# EAGLE design PSU (EAGLE 7.7.0)
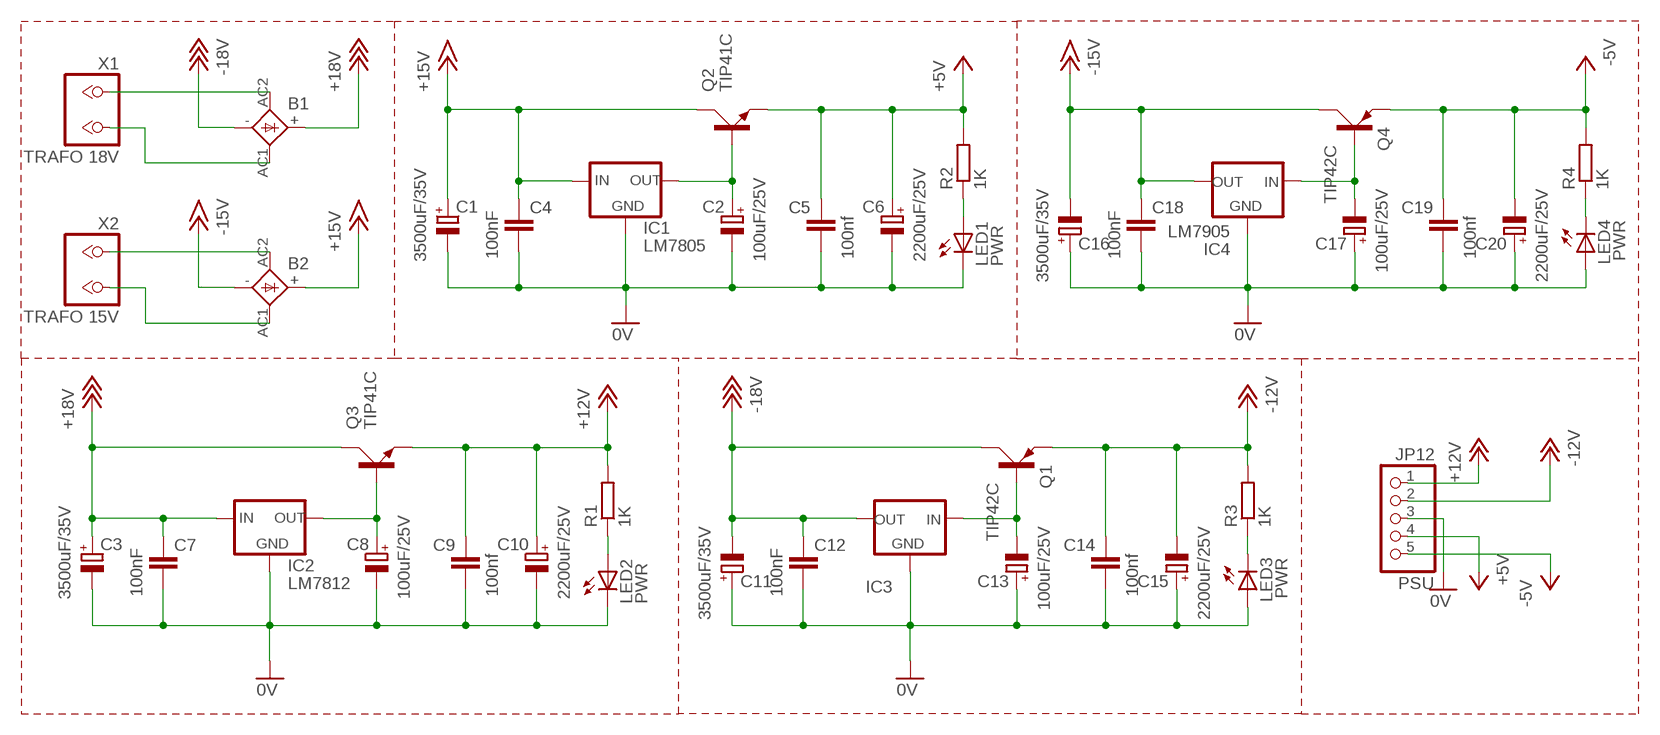
[diagram p0: schematic, sheet 1]

## Parts
B1  KBL  [KBL]
B2  KBL  [KBL]
C1  3500uF/35V  CPOL-EUE10-20  [EB20D]
C2  100uF/25V  CPOL-EUE2.5-7  [E2,5-7]
C3  3500uF/35V  CPOL-EUE10-20  [EB20D]
C4  100nF  C-EU050-025X075  [C050-025X075]
C5  100nf  C-EU050-025X075  [C050-025X075]
C6  2200uF/25V  CPOL-EUE5-13  [E5-13]
C7  100nF  C-EU050-025X075  [C050-025X075]
C8  100uF/25V  CPOL-EUE2.5-7  [E2,5-7]
C9  100nf  C-EU050-025X075  [C050-025X075]
C10  2200uF/25V  CPOL-EUE5-13  [E5-13]
C11  3500uF/35V  CPOL-EUE10-20  [EB20D]
C12  100nF  C-EU050-025X075  [C050-025X075]
C13  100uF/25V  CPOL-EUE2.5-7  [E2,5-7]
C14  100nf  C-EU050-025X075  [C050-025X075]
C15  2200uF/25V  CPOL-EUE5-13  [E5-13]
C16  3500uF/35V  CPOL-EUE10-20  [EB20D]
C17  100uF/25V  CPOL-EUE2.5-7  [E2,5-7]
C18  100nF  C-EU050-025X075  [C050-025X075]
C19  100nf  C-EU050-025X075  [C050-025X075]
C20  2200uF/25V  CPOL-EUE5-13  [E5-13]
IC1  LM7805  78XXS  [78XXS]
IC2  LM7812  78XXS  [78XXS]
IC3  79XXS  [79XXS]
IC4  LM7905  79XXS  [79XXS]
JP12  PSU  PINHD-1X5"  [1X05]
LED1  PWR  LEDLED3MM  [LED3MM]
LED2  PWR  LEDLED3MM  [LED3MM]
LED3  PWR  LEDLED3MM  [LED3MM]
LED4  PWR  LEDLED3MM  [LED3MM]
Q1  TIP42C  [TO220AV]
Q2  TIP41C  [TO220AV]
Q3  TIP41C  [TO220AV]
Q4  TIP42C  [TO220AV]
R1  1K  R-EU_0207/7  [0207/7]
R2  1K  R-EU_0207/7  [0207/7]
R3  1K  R-EU_0207/7  [0207/7]
R4  1K  R-EU_0207/7  [0207/7]
X1  TRAFO 18V  2PIN  [TB2]
X2  TRAFO 15V  2PIN  [TB2]

## Nets
0V: C1.- C2.- C3.- C4.2 C5.2 C6.- C7.2 C8.- C9.2 C10.- C11.+ C12.2 C13.+ C14.2 C15.+ C16.+ C17.+ C18.2 C19.2 C20.+ IC1.GND IC2.GND IC3.GND IC4.GND JP12.3 LED1.K(C) LED2.K(C) LED3.A LED4.A
+5V: C5.1 C6.+ JP12.4 Q2.E R2.2
+12V: C9.1 C10.+ JP12.1 Q3.E R1.2
+15V: B2.+ C1.+ C4.1 IC1.IN Q2.C
+18V: B1.+ C3.+ C7.1 IC2.IN Q3.C
-5V: C19.1 C20.- JP12.5 Q4.E R4.2
-12V: C14.1 C15.- JP12.2 Q1.E R3.2
-15V: B2.- C16.- C18.1 IC4.OUT Q4.C
-18V: B1.- C11.- C12.1 IC3.OUT Q1.C
N$1: B1.AC1(AC2) X1.2
N$2: B1.AC2(AC1) X1.1
N$3: C13.- IC3.IN Q1.B
N$4: LED1.A R2.1
N$5: C8.+ IC2.OUT Q3.B
N$6: C2.+ IC1.OUT Q2.B
N$7: LED2.A R1.1
N$8: LED3.K(C) R3.1
N$13: C17.- IC4.IN Q4.B
N$14: LED4.K(C) R4.1
N$15: B2.AC2(AC1) X2.1
N$16: B2.AC1(AC2) X2.2

## Library data of the parts
B1 B2 = rectifier:KBL: DIOTEC RECTIFIER
C1-C3 C6 C8 C10 C11 C13 C15-C17 C20 = FansElectronics-RCL:CPOL-EU: POLARIZED CAPACITOR, European symbol
C4 C5 C7 C9 C12 C14 C18 C19 = FansElectronics-RCL:C-EU: CAPACITOR, European symbol
IC1 IC2 = v-reg:78XXS: VOLTAGE REGULATOR
IC3 IC4 = v-reg:79XXS: VOLTAGE REGULATOR
JP12 = FansElectronics-Header:PINHD-1X5: PIN HEADER
LED1-LED4 = FansElectronics-LED:LED: LED : Tersedia berbagai ukuran dari DIL dan SMD
Q1 Q4 = transistor-power:TIP42C: PNP TRANSISTOR
Q2 Q3 = transistor-power:TIP41C: NPN TRANSISTOR
R1-R4 = FansElectronics-RCL:R-EU_: RESISTOR, European symbol
X1 X2 = FansElectronics-Con-Screw:2PIN

## Board
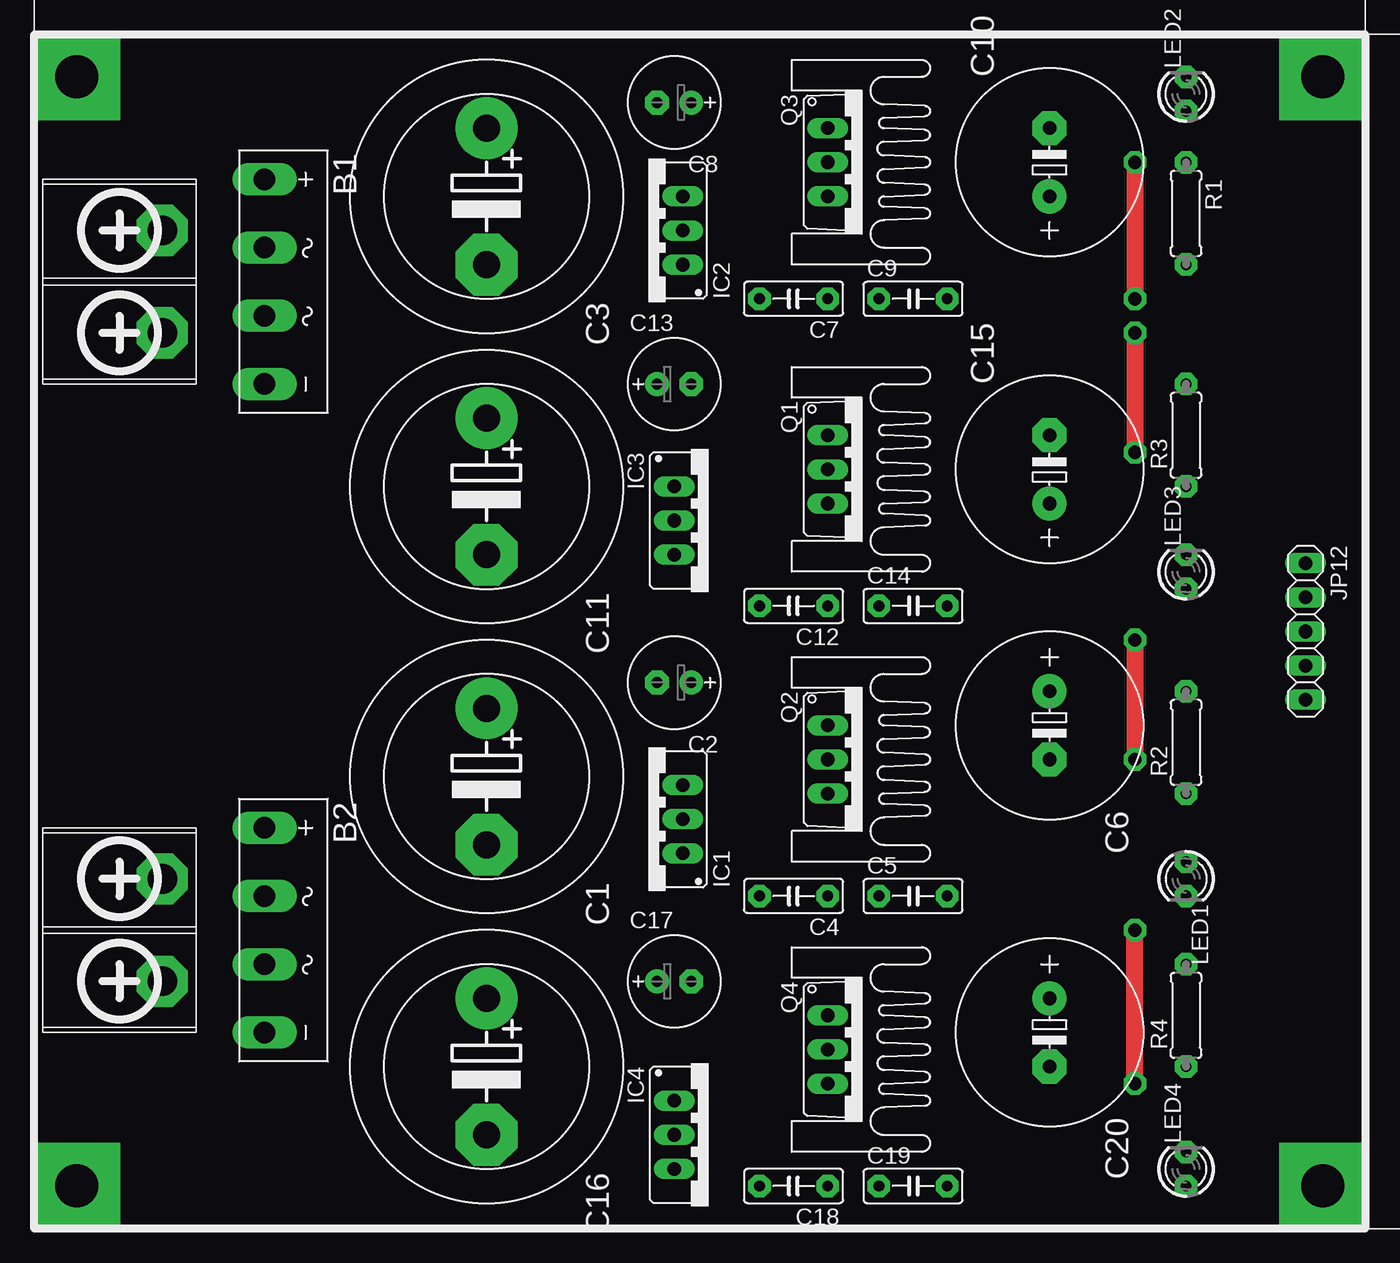
[diagram p1: board, top side]
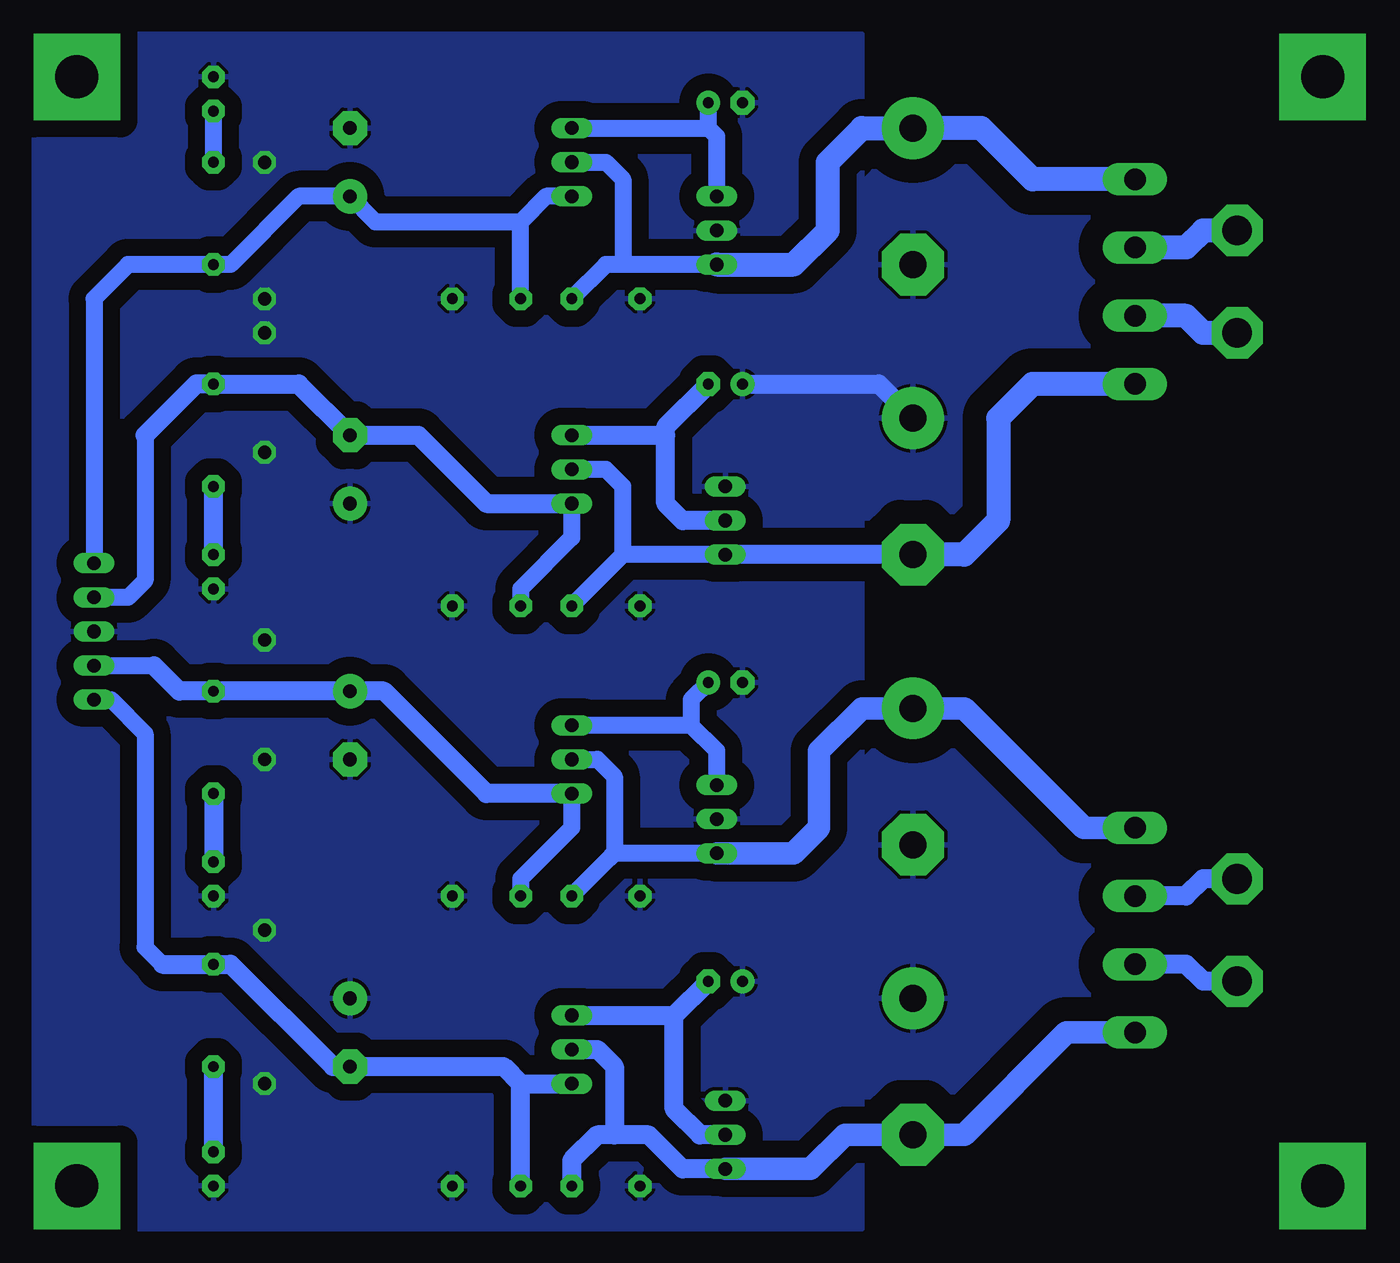
[diagram p2: board, bottom side, seen from below]

No outline drawn. Coordinates in mm, seen from the top.
Copper layers (1*16): Top 0.035mm / dielectric 1.5mm / Bottom 0.035mm
Design rules "default": minimum track width 10mil, minimum drill 24mil, track to track 8mil, track to pad 8mil, pad to pad 8mil, via to via 8mil, smd to smd 8mil, copper to edge 40mil, drill to drill 8mil, minimum pad ring 10mil, minimum via ring 8mil, stop-mask expansion 4mil, vias tented up to drill 0mil, thermal gap 10mil

### Footprints (pad centres in the part's own frame; a part is rotated, then mirrored left to right if it is on the bottom)
KBL = drill 1.6 long: + -7.62,-1.27; - 7.62,-1.27; AC1 2.54,-1.27; AC2 -2.54,-1.27
EB20D = drill 2.007 pad 4.597: + -5.08,0 | drill 2.007 pad 4.597 octagon: - 5.08,0
E2,5-7 = drill 0.813 pad 1.778: + -1.27,0 | drill 0.813 pad 1.778 octagon: - 1.27,0
C050-025X075 = drill 0.813 pad 1.676 octagon: 1 -2.54,0; 2 2.54,0
E5-13 = drill 1.016 pad 2.54: + -2.54,0 | drill 1.016 pad 2.54 octagon: - 2.54,0
78XXS = drill 1.016 long: GND 0,-2.54; IN -2.54,-2.54; OUT 2.54,-2.54
79XXS = drill 1.016 long: GND -2.54,-2.54; IN 0,-2.54; OUT 2.54,-2.54
1X05 = drill 1.016 long: 1 -5.08,0; 2 -2.54,0; 3 0,0; 4 2.54,0; 5 5.08,0
LED3MM = drill 0.813 pad 1.676 octagon: A -1.27,0; K 1.27,0
TO220AV = drill 1.016 long: B -2.54,-2.54; C 0,-2.54; E 2.54,-2.54
0207/7 = drill 0.813 pad 1.676 octagon: 1 -3.81,0; 2 3.81,0
TB2 = drill 2.2 pad 3.81 octagon: 1 -3.81,0; 2 3.81,0

### Placement (x,y rotation side)
B1  -33.02,-196.85 270 top
B2  -33.02,-245.11 270 top
C1  -17.78,-233.68 270 top
C2  -3.81,-226.69 180 top
C3  -17.78,-190.5 270 top
C4  5.08,-242.57 180 top
C5  13.97,-242.57 0 top
C6  24.13,-229.87 270 top
C7  5.08,-198.12 180 top
C8  -3.81,-183.51 180 top
C9  13.97,-198.12 0 top
C10  24.13,-187.96 90 top
C11  -17.78,-212.09 270 top
C12  5.08,-220.98 180 top
C13  -3.81,-204.47 0 top
C14  13.97,-220.98 0 top
C15  24.13,-210.82 90 top
C16  -17.78,-255.27 270 top
C17  -3.81,-248.92 0 top
C18  5.08,-264.16 180 top
C19  13.97,-264.16 0 top
C20  24.13,-252.73 270 top
IC1  -5.71,-236.85 90 top
IC2  -5.71,-193.04 90 top
IC3  -1.27,-214.63 270 top
IC4  -1.27,-260.35 270 top
JP12  43.18,-222.88 270 top
LED1  34.29,-241.3 270 top
LED2  34.29,-182.88 90 top
LED3  34.29,-218.44 90 top
LED4  34.29,-262.89 90 top
Q1  10.16,-210.82 270 top
Q2  10.16,-232.41 270 top
Q3  10.16,-187.96 270 top
Q4  10.16,-254 270 top
R1  34.29,-191.77 270 top
R2  34.29,-231.14 90 top
R3  34.29,-208.28 90 top
R4  34.29,-251.46 90 top
U$1  [SK95-2M3]  10.16,-232.41 270 top
U$2  [SK95-2M3]  10.16,-187.96 270 top
U$3  [SK95-2M3]  10.16,-210.82 270 top
U$4  [SK95-2M3]  10.16,-254 270 top
X1  -41.91,-196.85 270 top
X2  -41.91,-245.11 270 top

### Tracks (layer width: path | path; a pad name or v marks a point on that pad's centre or on a via)
0V  (via drill 1 pad 1.68)
  Top 1.27: v30.48,-223.52 v30.48,-232.41 | v30.48,-256.54 v30.48,-245.11 | v30.48,-187.96 v30.48,-198.12 | v30.48,-200.66 v30.48,-209.55
  Bottom 1.422: C13.+ -15.24,-204.47 C11.+
  pour Bottom (isolate 1.778): -51.44,-178.44 -13.97,-178.44 -13.97,-267.33 -51.44,-267.33
  pour Bottom (isolate 1.27): -13.97,-178.44 47.62,-178.44 47.62,-267.33 -13.97,-267.33
+5V
  Bottom 1.27: Q2.E 7.62,-237.49 11.43,-241.3 C5.1 | JP12.4 38.73,-225.43
  Bottom 1.422: Q2.E 13.97,-234.95 21.59,-227.33 C6.+ R2.2 36.83,-227.33 38.73,-225.43
+12V
  Bottom 1.27: Q3.E 9.53,-190.5 11.43,-192.41 | 11.43,-192.41 22.23,-192.41 C10.+ 27.94,-190.5 33.02,-195.58 R1.2 40.64,-195.58 43.18,-198.12 JP12.1 | C9.1 11.43,-192.41
+15V
  Bottom 1.27: IC1.IN 4.45,-239.4 | C4.1 4.76,-239.71 4.45,-239.4 | Q2.C 5.71,-232.41 4.45,-233.68 4.45,-239.4
  Bottom 1.676: B2.+ -30.48,-237.49 -21.59,-228.6 C1.+ -13.97,-228.6 -10.79,-231.78 -10.79,-237.49 -8.89,-239.4 IC1.IN
+18V
  Bottom 1.27: IC2.IN 3.81,-195.58 | 3.81,-195.58 5.08,-195.58 C7.1 | Q3.C 5.08,-187.96 3.81,-189.23 3.81,-195.58
  Bottom 1.778: B1.+ -26.67,-189.23 -22.86,-185.42 C3.+ -13.97,-185.42 -11.43,-187.96 -11.43,-193.04 -8.89,-195.58 IC2.IN
-5V
  Bottom 1.27: JP12.5 41.91,-227.97 39.37,-230.5 39.37,-246.38 38.1,-247.65
  Bottom 1.422: 38.1,-247.65 R4.2 33.02,-247.65 25.4,-255.27 C20.- 12.7,-255.27 11.43,-256.54 | 11.43,-256.54 Q4.E | C19.1 11.43,-256.54
-12V
  Bottom 1.27: Q1.E 7.62,-215.9 11.43,-219.71 C14.1 | 39.37,-208.28 39.37,-219.07 40.64,-220.34 JP12.2
  Bottom 1.422: Q1.E 13.97,-213.36 19.05,-208.28 C15.- 27.94,-204.47 R3.2 35.56,-204.47 39.37,-208.28
-15V
  Bottom 1.422: IC4.OUT -0.64,-262.89 1.91,-260.35 4.45,-260.35 | 4.45,-260.35 5.71,-260.35 7.62,-262.25 C18.1 | Q4.C 5.71,-254 4.45,-255.27 4.45,-260.35
  Bottom 1.676: B2.- -29.21,-252.73 -21.59,-260.35 C16.- -12.7,-260.35 -10.16,-262.89 IC4.OUT
-18V
  Bottom 1.27: IC3.OUT 3.81,-217.17 | 3.81,-217.17 C12.1 | 3.81,-217.17 3.81,-212.09 5.08,-210.82 Q1.C
  Bottom 1.422: C11.- IC3.OUT
  Bottom 1.778: B1.- -26.67,-204.47 -24.13,-207.01 -24.13,-214.63 -21.59,-217.17 C11.-
N$1
  Bottom 1.778: X1.2 -39.37,-200.66 -38.1,-199.39 B1.AC1
N$2
  Bottom 1.778: X1.1 -39.37,-193.04 -38.1,-194.31 B1.AC2
N$3
  Bottom 1.422: IC3.IN -0.64,-214.63 0.64,-213.36 0.64,-208.28 | 0.64,-208.28 0.64,-207.65 C13.- | Q1.B 0.64,-208.28
N$4
  Bottom 1.422: R2.1 LED1.A
N$5
  Bottom 1.27: IC2.OUT -3.17,-186.06 -2.54,-185.42 | -2.54,-185.42 C8.+ | Q3.B -2.54,-185.42
N$6
  Bottom 1.27: IC1.OUT -3.17,-231.78 -1.27,-229.87 | -1.27,-229.87 Q2.B | C2.+ -1.27,-227.97 -1.27,-229.87
N$7
  Bottom 1.27: R1.1 LED2.A
N$8
  Bottom 1.422: LED3.K R3.1
N$9  (via drill 3.2 pad 6.45)
  other vias: -48.26,-181.61
N$10  (via drill 3.2 pad 6.45)
  other vias: -48.26,-264.16
N$11  (via drill 3.2 pad 6.45)
  other vias: 44.45,-181.61
N$12  (via drill 3.2 pad 6.45)
  other vias: 44.45,-264.16
N$13
  Bottom 1.422: IC4.IN -1.91,-260.35 0,-258.44 0,-251.46 | 0,-251.46 C17.- | Q4.B 0,-251.46
N$14
  Bottom 1.422: LED4.K R4.1
N$15
  Bottom 1.422: X2.1 -39.37,-241.3 -38.1,-242.57 B2.AC2
N$16
  Bottom 1.422: X2.2 -39.37,-248.92 -38.1,-247.65 B2.AC1